# Altium project VatorMonitor.PrjPcb
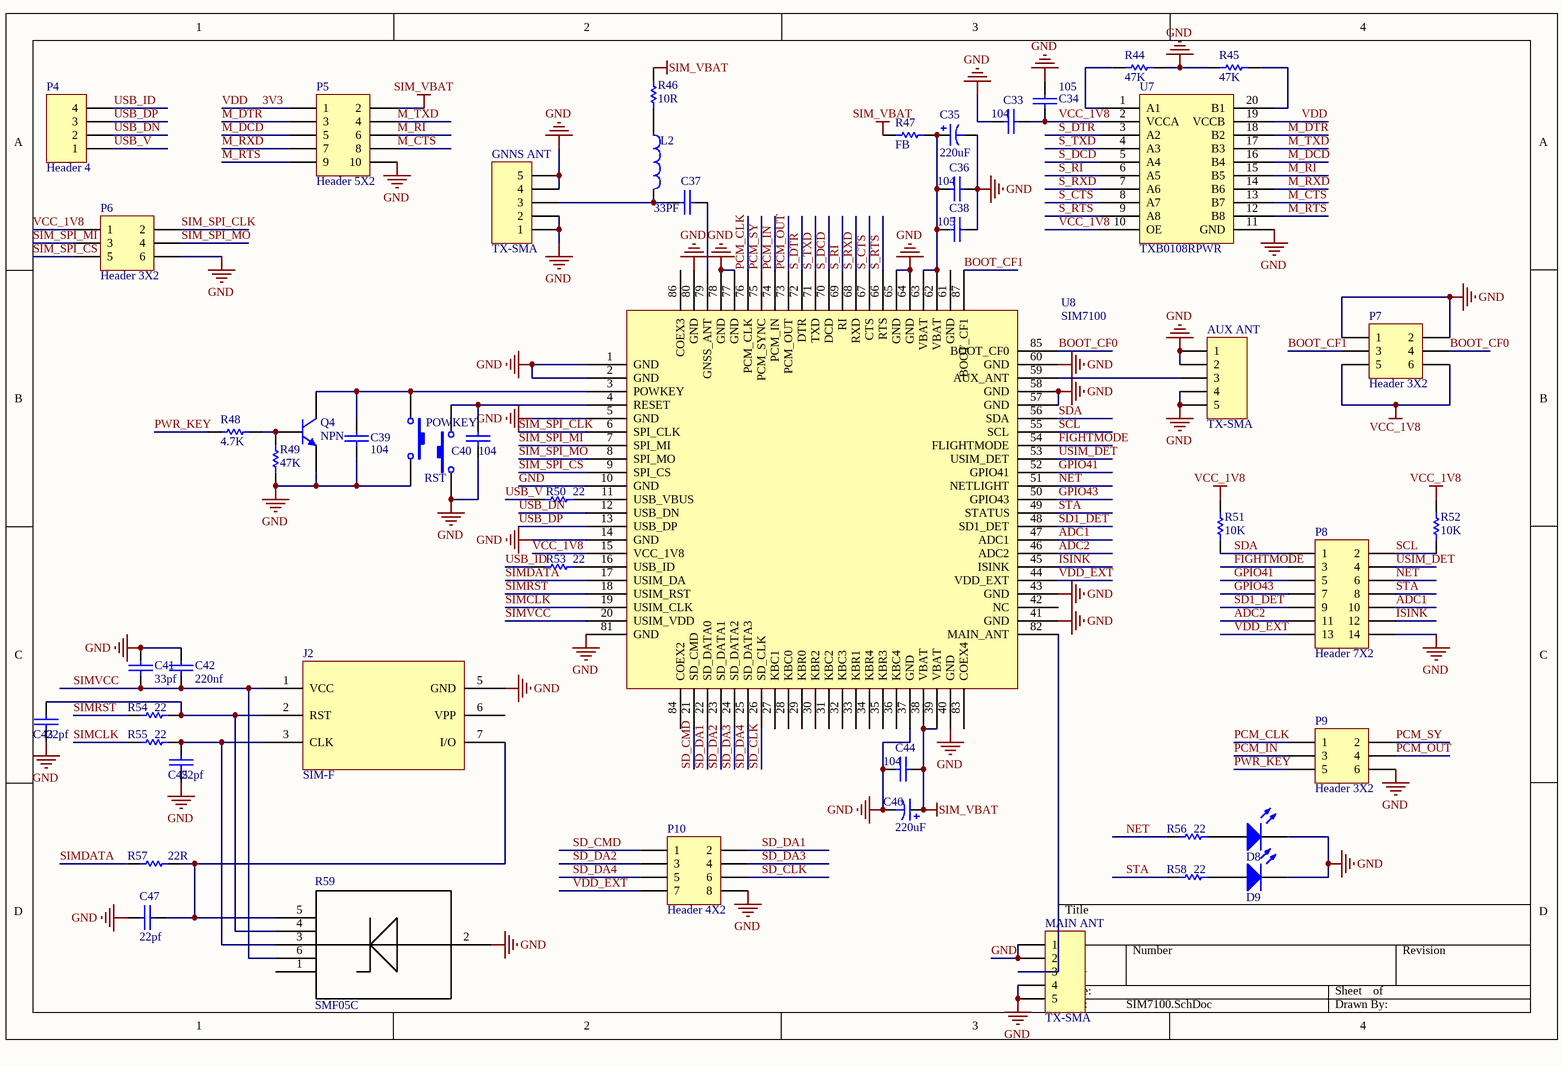
[diagram p0: SIM7100.SchDoc]
6 sheets, 122 parts. Net scope: flat (ports and power ports of the same name join across sheets).
Board file: VatorMonitor.PcbDoc
Sheets:
  SIM7100.SchDoc
  LCD.SchDoc
  LED_KEYBOARD.SchDoc
  MCU.SchDoc
  MCU_DBG.SchDoc
  PIN_HEADER.SchDoc

## Sheet SIM7100.SchDoc
size A4

### Parts
(Parts that share a designator on the sheet are numbered #1, #2 ... from top to bottom, then left to right.)
AUX_ANT  TX-SMA  [SMA]
C33  104  [RC0805]
C34  105  [RC0805]
C35  value 220uF  [CAP(100uF)]  (hidden comment: 407uF)
C36  104  [RC0805]
C37  33PF  [RC0805]
C38  105  [RC0805]
C39  104  [RC0805]
C40  104  [RC0805]
C41  33pf  [RC0805]
C42  220nf  [RC0805]
C43  22pf  [RC0805]
C44  104  [RC0805]
C45  22pf  [RC0805]
C46  value 220uF  [CAP(100uF)]  (hidden comment: 407uF)
C47  22pf  [RC0805]
D8  LED0  [LED-0805]  (value not drawn)
D9  LED0  [LED-0805]  (value not drawn)
GNNS_ANT  TX-SMA  [SMA]
J2  SIM-F  [SIM_FG]
L2  Inductor  [RC0805]  (value not drawn)
MAIN_ANT  TX-SMA  [SMA]
P4  Header 4  [HDR1X4]
P5#1  Header 5X2  [HDR2X5]
P6#1  Header 3X2  [HDR2X3]
P7  Header 3X2  [HDR2X3]
P8  Header 7X2  [HDR2X7]
P9  Header 3X2  [HDR2X3]
P10  Header 4X2  [HDR2X4]
POWKEY  SW-PB  [小按键]  (value not drawn)
Q4  NPN  [to-92a]
R44  value 47K  [RC0805]  (hidden comment: Res1)
R45  value 47K  [RC0805]  (hidden comment: Res1)
R46  value 10R  [RC0805]  (hidden comment: Res1)
R47  value FB  [1206]  (hidden comment: Res1)
R48  value 4.7K  [RC0805]  (hidden comment: Res1)
R49  value 47K  [RC0805]  (hidden comment: Res1)
R50  value 22  [RC0805]  (hidden comment: Res1)
R51  value 10K  [RC0805]  (hidden comment: Res1)
R52  value 10K  [RC0805]  (hidden comment: Res1)
R53  value 22  [RC0805]  (hidden comment: Res1)
R54  value 22  [RC0805]  (hidden comment: Res1)
R55  value 22  [RC0805]  (hidden comment: Res1)
R56  value 22  [RC0805]  (hidden comment: Res1)
R57  value 22R  [RC0805]  (hidden comment: Res1)
R58  value 22  [RC0805]  (hidden comment: Res1)
R59  SMF05C  [SOT-363]
RST  SW-PB  [小按键]  (value not drawn)
U7  TXB0108RPWR  [R-PDSO-20]
U8  SIM7100  [SIM7100]

### Nets
GND: AUX_ANT.1 AUX_ANT.2 AUX_ANT.4 AUX_ANT.5 C33.1 C34.2 C35.2 C36.2 C38.2 C39.2 C40.2 C41.2 C42.2 C43.1 C44.1 C45.1 C46.2 C47.2 D8.2(K) D9.2(K) GNNS_ANT.1 GNNS_ANT.2 GNNS_ANT.4 GNNS_ANT.5 J2.5(GND) MAIN_ANT.1 MAIN_ANT.2 MAIN_ANT.4 MAIN_ANT.5 P5#1.10 P6#1.6 P7.1 P7.2 P8.14 P9.6 P10.8 POWKEY.2 Q4.1(E) R44.1 R45.2 R49.1 R59.2(I/O) RST.1 U7.11(GND) U8.1(GND) U8.2(GND) U8.5(GND) U8.10(GND) U8.14(GND) U8.37(GND) U8.40(GND) U8.41(GND) U8.43(GND) U8.57(GND) U8.58(GND) U8.60(GND) U8.64(GND) U8.65(GND) U8.77(GND) U8.78(GND) U8.80(GND) U8.81(GND)
SIM_VBAT: C44.2 C46.1 P5#1.2 R46.2 R47.1 U8.38(VBAT) U8.39(VBAT)
VCC_1V8: C33.2 C34.1 P6#1.1 P7.5 P7.6 R51.2 R52.2 U7.2(VCCA) U7.10(OE) U8.15(VCC_1V8)
3V3: P5#1.1 U7.19(VCCB)  [also labelled VDD]
ADC1: P8.10 U8.47(ADC1)
ADC2: P8.11 U8.46(ADC2)
BOOT_CF0: P7.4 U8.85(BOOT_CF0)
BOOT_CF1: P7.3 U8.87(BOOT_CF1)
FIGHTMODE: P8.3 U8.54(FLIGHTMODE)
GPIO41: P8.5 U8.52(GPIO41)
GPIO43: P8.7 U8.50(GPIO43)
ISINK: P8.12 U8.45(ISINK)
M_CTS: P5#1.8 U7.13(B7)
M_DCD: P5#1.5 U7.16(B4)
M_DTR: P5#1.3 U7.18(B2)
M_RI: P5#1.6 U7.15(B5)
M_RTS: P5#1.9 U7.12(B8)
M_RXD: P5#1.7 U7.14(B6)
M_TXD: P5#1.4 U7.17(B3)
NET: P8.6 R56.1 U8.51(NETLIGHT)
PCM_CLK: P9.1 U8.76(PCM_CLK)
PCM_IN: P9.3 U8.74(PCM_IN)
PCM_OUT: P9.4 U8.73(PCM_OUT)
PCM_SY: P9.2 U8.75(PCM_SYNC)
PWR_KEY: P9.5 R48.1
S_CTS: U7.8(A7) U8.67(CTS)
S_DCD: U7.5(A4) U8.70(DCD)
S_DTR: U7.3(A2) U8.72(DTR)
S_RI: U7.6(A5) U8.69(RI)
S_RTS: U7.9(A8) U8.66(RTS)
S_RXD: U7.7(A6) U8.68(RXD)
S_TXD: U7.4(A3) U8.71(TXD)
SCL: P8.2 R52.1 U8.55(SCL)
SD1_DET: P8.9 U8.48(SD1_DET)
SD_CLK: P10.6 U8.26(SD_CLK)
SD_CMD: P10.1 U8.21(SD_CMD)
SD_DA1: P10.2 U8.22(SD_DATA0)
SD_DA2: P10.3 U8.23(SD_DATA1)
SD_DA3: P10.4 U8.24(SD_DATA2)
SD_DA4: P10.5 U8.25(SD_DATA3)
SDA: P8.1 R51.1 U8.56(SDA)
SIM_SPI_CLK: P6#1.2 U8.6(SPI_CLK)
SIM_SPI_CS: P6#1.5 U8.9(SPI_CS)
SIM_SPI_MI: P6#1.3 U8.7(SPI_MI)
SIM_SPI_MO: P6#1.4 U8.8(SPI_MO)
SIMCLK: R55.1 U8.19(USIM_CLK)
SIMDATA: R57.1 U8.17(USIM_DA)
SIMRST: R54.1 U8.18(USIM_RST)
SIMVCC: C41.1 C42.1 J2.1(VCC) R59.6(I/O) U8.20(USIM_VDD)
STA: P8.8 R58.1 U8.49(STATUS)
USB_DN: P4.2 U8.12(USB_DN)
USB_DP: P4.3 U8.13(USB_DP)
USB_ID: P4.4 R53.1
USB_V: P4.1 R50.1
USIM_DET: P8.4 U8.53(USIM_DET)
VDD_EXT: P8.13 P10.7 U8.44(VDD_EXT)
NetAUX_ANT_3: AUX_ANT.3 U8.59(AUX_ANT)
NetC35_1: C35.1 C36.1 C38.1 R47.2 U8.62(VBAT) U8.63(VBAT)
NetC37_1: C37.1 GNNS_ANT.3 L2.2
NetC37_2: C37.2 U8.79(GNSS_ANT)
NetC39_1: C39.1 POWKEY.1 Q4.3(C) U8.3(POWKEY)
NetC40_1: C40.1 RST.2 U8.4(RESET)
NetC43_2: C43.2 J2.2(RST) R54.2 R59.4(I/O)
NetC45_2: C45.2 J2.3(CLK) R55.2 R59.3(I/O)
NetC47_1: C47.1 J2.7(I/O) R57.2 R59.5(I/O)
NetD8_1: D8.1(A) R56.2
NetD9_1: D9.1(A) R58.2
NetL2_1: L2.1 R46.1
NetMAIN_ANT_3: MAIN_ANT.3 U8.82(MAIN_ANT)
NetQ4_2: Q4.2(B) R48.2 R49.2
NetR44_2: R44.2 U7.1(A1)
NetR45_1: R45.1 U7.20(B1)
NetR50_2: R50.2 U8.11(USB_VBUS)
NetR53_2: R53.2 U8.16(USB_ID)

Not connected (* = marked no-connect by the designer): J2 6(VPP); R59 1(I/O); U8 27(KBC1) 28(KBC0) 29(KBR0) 30(KBR2) 31(KBC2) 32(KBC3) 33(KBR1) 34(KBR4) 35(KBR3) 36(KBC4) 42(NC) 61(GND) 83(COEX4) 84(COEX2) 86(COEX3)

### Library data of the parts
AUX_ANT GNNS_ANT MAIN_ANT = Header 5: Header, 5-Pin; LatestRevisionDate: 17-Jul-2002; LatestRevisionNote: Re-released for DXP Platform.; Publisher: Altium Limited
C33 C34 C36-C45 C47 = CAP: Capacitor
C35 C46 = Cap Pol1: Polarized Capacitor (Radial); Published: 8-Jun-2000; LatestRevisionDate: 17-Jul-2002; LatestRevisionNote: Re-released for DXP Platform.; PackageReference: RB7.6-15; Publisher: Altium Limited
D8 D9 = LED0: Typical INFRARED GaAs LED; Published: 8-Jun-2000; LatestRevisionDate: 08-Jul-2005; LatestRevisionNote: Mech Layer 1 removed.; PackageReference: LED-0; Publisher: Altium Limited; PackageDescription: LED; 2 Leads
L2 = Inductor: Code_IEC: 1005; Value: 10mH; Published: 8-Jun-2000; LatestRevisionDate: 29-May-2009; LatestRevisionNote: IPC-7351 Footprint Added.; PackageReference: 0402-A; Publisher: Altium Limited; PackageDescription: Chip Inductor; Code_JEITA: 0402
P4 = Header 4: Header, 4-Pin; LatestRevisionDate: 17-Jul-2002; LatestRevisionNote: Re-released for DXP Platform.; Publisher: Altium Limited
P5#1 = Header 5X2: Header, 5-Pin, Dual row; LatestRevisionDate: 17-Jul-2002; LatestRevisionNote: Re-released for DXP Platform.; Publisher: Altium Limited
P6#1 P7 P9 = Header 3X2: Header, 3-Pin, Dual row; LatestRevisionDate: 17-Jul-2002; LatestRevisionNote: Re-released for DXP Platform.; Publisher: Altium Limited
P8 = Header 7X2: Header, 7-Pin, Dual row; LatestRevisionDate: 17-Jul-2002; LatestRevisionNote: Re-released for DXP Platform.; Publisher: Altium Limited
P10 = Header 4X2: Header, 4-Pin, Dual row; LatestRevisionDate: 17-Jul-2002; LatestRevisionNote: Re-released for DXP Platform.; Publisher: Altium Limited
POWKEY RST = SW-PB: Switch; Published: 24-Mar-1999; LatestRevisionDate: 17-Jul-2002; LatestRevisionNote: Re-released for DXP Platform.; PackageReference: SPST-2; Publisher: Altium Limited; PackageDescription: Switch; 2 Leads
Q4 = 2N3904: NPN General Purpose Amplifier; Published: 8-Jun-2000; LatestRevisionDate: 15-Jan-2003; LatestRevisionNote: PCB Footprint 'BCY-W3/D4.7' replaced; DatasheetVersion: 1997; PackageVersion: Sep-1998; PackageReference: TO-92A; Publisher: Altium Limited; PackageDescription: TO, Flat Index; 3 In-Line, Axial Leads; Body Dia. 4.5mm; Leads 0.51 x 0.48 mm (max); ComponentLink1Description: Manufacturer Link; ComponentLink1URL: http://www.fairchildsemi.com/; ComponentLink2Description: Datasheet; ComponentLink2URL: http://www.fairchildsemi.com/ds/2N%2F2N3904.pdf
R44-R58 = Res1: Resistor; Published: 8-Jun-2000; LatestRevisionDate: 17-Jul-2002; LatestRevisionNote: Re-released for DXP Platform.; PackageReference: AXIAL-0.3; Publisher: Altium Limited; PackageDescription: Axial Device, Thru-Hole; 2 Leads; 0.3 in Pin Spacing

## Sheet LCD.SchDoc
size A4
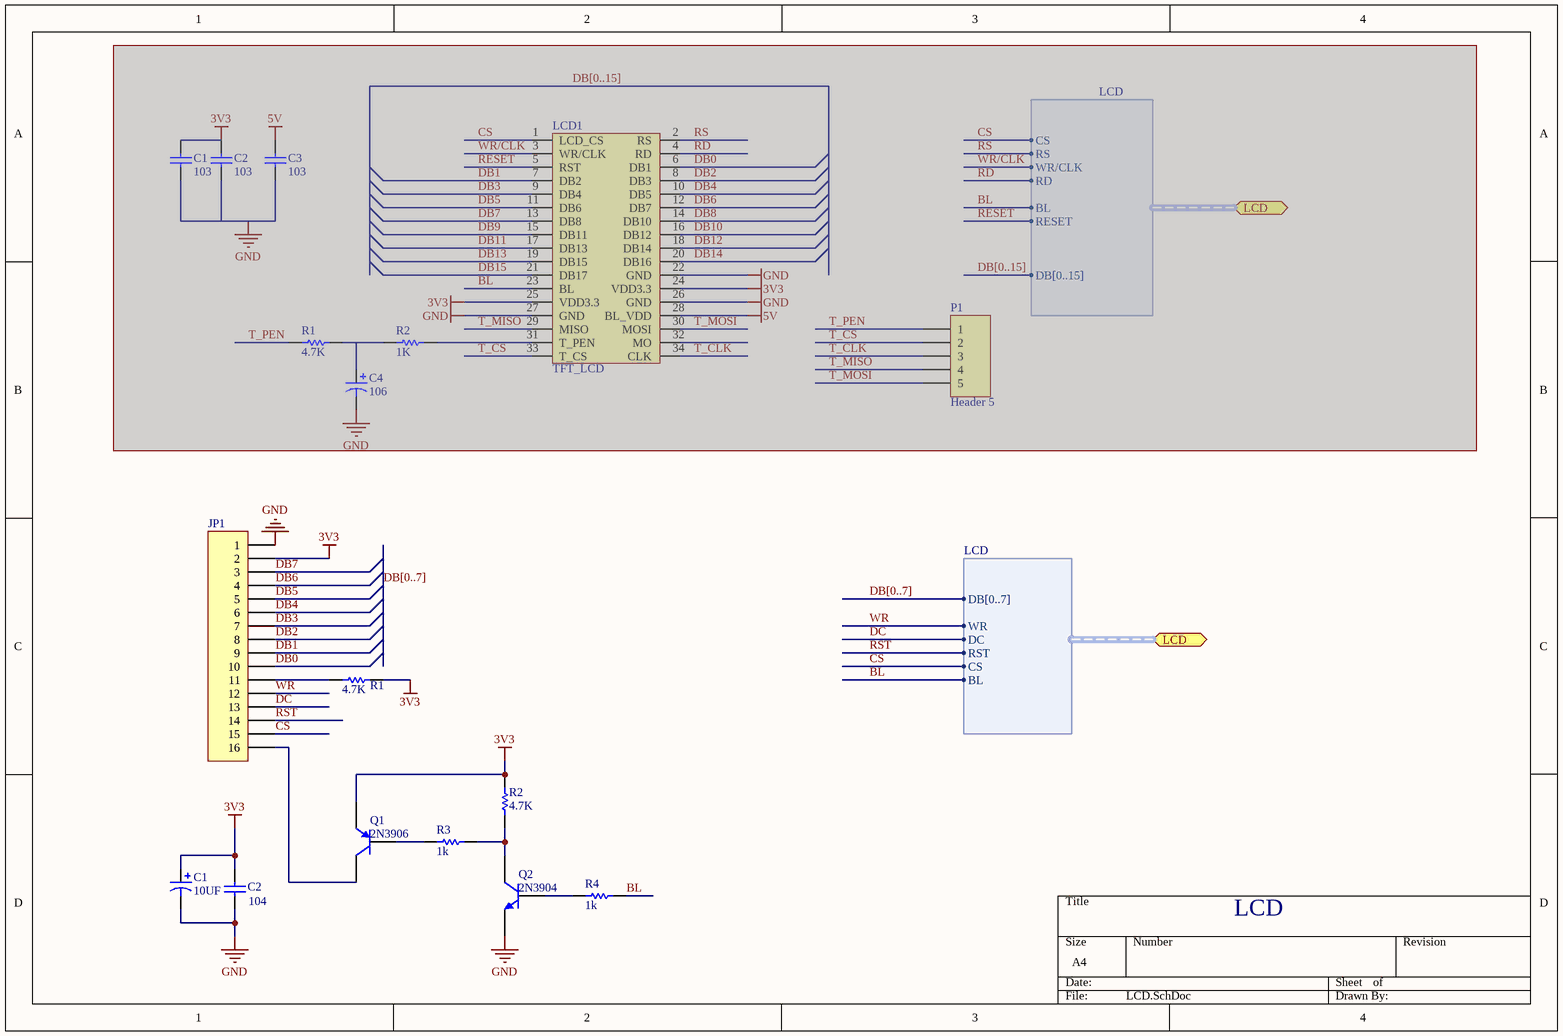
[diagram p1: LCD.SchDoc]

### Parts
(Parts that share a designator on the sheet are numbered #1, #2 ... from top to bottom, then left to right.)
C1#1  value 103  [RC0805]  (hidden comment: Cap)  (masked out: inside a compile mask, not in the netlist)
C1#2  value 10UF  [CAP(106C)]  (hidden comment: Cap Pol1)
C2#1  value 103  [RC0805]  (hidden comment: Cap)  (masked out: inside a compile mask, not in the netlist)
C2#2  value 104  [RC0805]  (hidden comment: Cap)
C3#1  value 103  [RC0805]  (hidden comment: Cap)  (masked out: inside a compile mask, not in the netlist)
C4#1  value 106  [CAP(106C)]  (hidden comment: Cap Pol1)  (masked out: inside a compile mask, not in the netlist)
JP1  Header 16  [LCD240120]  (value not drawn)
LCD1  TFT_LCD  [DB2*17]  (masked out: inside a compile mask, not in the netlist)
P1#1  Header 5  [HDR1X5]  (masked out: inside a compile mask, not in the netlist)
Q1  2N3906  [SOT-23R]
Q2  2N3904  [SOT-23R]
R1#1  value 4.7K  [RC0805]  (hidden comment: Res1)  (masked out: inside a compile mask, not in the netlist)
R1#2  value 4.7K  [RC0805]  (hidden comment: Res1)
R2#1  value 1K  [RC0805]  (hidden comment: Res1)  (masked out: inside a compile mask, not in the netlist)
R2#2  value 4.7K  [RC0805]  (hidden comment: Res1)
R3  value 1k  [RC0805]  (hidden comment: Res1)
R4  value 1k  [RC0805]  (hidden comment: Res1)

### Ports
LCD (harness LCD)

### Harnesses
LCD: CS, RS, WR/CLK, RD, BL, RESET, DB[0..15]
LCD: DB[0..7], WR, DC, RST, CS, BL

### Nets
3V3: C1#2.1 C2#2.1 JP1.2 Q1.1(E) R1#2.2 R2#2.2
GND: C1#2.2 C2#2.2 JP1.1 Q2.1(E)
BL: R4.2 ; port LCD.BL
CS: JP1.15 ; port LCD.CS
DB0: JP1.10
DB1: JP1.9
DB2: JP1.8
DB3: JP1.7
DB4: JP1.6
DB5: JP1.5
DB6: JP1.4
DB7: JP1.3
DC: JP1.13 ; port LCD.DC
RST: JP1.14 ; port LCD.RST  [project net LCD.RST]
WR: JP1.12 ; port LCD.WR  [project net LCD.WR]
NetJP1_11: JP1.11 R1#2.1
NetJP1_16: JP1.16 Q1.3(C)
NetQ1_2: Q1.2(B) R3.1
NetQ2_2: Q2.2(B) R4.1
NetQ2_3: Q2.3(C) R2#2.1 R3.2

### Buses and harness runs
bus DB[0..7]

### Notes on the sheet
- LCD

### Library data of the parts
C1#1 C2#1 C2#2 C3#1 = Cap: Capacitor; Published: 8-Jun-2000; LatestRevisionDate: 17-Jul-2002; LatestRevisionNote: Re-released for DXP Platform.; PackageReference: RAD-0.3; Publisher: Altium Limited; PackageDescription: Radial Cap, Thru-Hole; 2 Leads; 0.3 in Pin Spacing
C1#2 C4#1 = Cap Pol1: Polarized Capacitor (Radial); Published: 8-Jun-2000; LatestRevisionDate: 17-Jul-2002; LatestRevisionNote: Re-released for DXP Platform.; PackageReference: RB7.6-15; Publisher: Altium Limited; PackageDescription: Polarized Capacitor (Radial); 2 Leads
JP1 = Header 16: Header, 16-Pin; Revision: 17-Jul-2002: Re-released for DXP Platform.; Publisher: Altium Limited
P1#1 = Header 5: Header, 5-Pin; LatestRevisionDate: 17-Jul-2002; LatestRevisionNote: Re-released for DXP Platform.; Publisher: Altium Limited
Q1 = 2N3906: PNP General Purpose Amplifier; Published: 8-Jun-2000; LatestRevisionDate: 15-Jan-2003; LatestRevisionNote: PCB Footprint 'BCY-W3/D4.7' replaced; DatasheetVersion: 1997; PackageVersion: Sep-1998; PackageReference: TO-92A; Publisher: Altium Limited; PackageDescription: TO, Flat Index; 3 In-Line, Axial Leads; Body Dia. 4.5mm; Leads 0.51 x 0.48 mm (max); ComponentLink1Description: Manufacturer Link; ComponentLink1URL: http://www.fairchildsemi.com/; ComponentLink2Description: Datasheet; ComponentLink2URL: http://www.fairchildsemi.com/ds/2N%2F2N3906.pdf
Q2 = 2N3904: NPN General Purpose Amplifier; Published: 8-Jun-2000; LatestRevisionDate: 15-Jan-2003; LatestRevisionNote: PCB Footprint 'BCY-W3/D4.7' replaced; DatasheetVersion: 1997; PackageVersion: Sep-1998; PackageReference: TO-92A; Publisher: Altium Limited; PackageDescription: TO, Flat Index; 3 In-Line, Axial Leads; Body Dia. 4.5mm; Leads 0.51 x 0.48 mm (max); ComponentLink1Description: Manufacturer Link; ComponentLink1URL: http://www.fairchildsemi.com/; ComponentLink2Description: Datasheet; ComponentLink2URL: http://www.fairchildsemi.com/ds/2N%2F2N3904.pdf
R1#1 R1#2 R2#1 R2#2 R3 R4 = Res1: Resistor; Published: 8-Jun-2000; LatestRevisionDate: 17-Jul-2002; LatestRevisionNote: Re-released for DXP Platform.; PackageReference: AXIAL-0.3; Publisher: Altium Limited; PackageDescription: Axial Device, Thru-Hole; 2 Leads; 0.3 in Pin Spacing

## Sheet LED_KEYBOARD.SchDoc
size A4
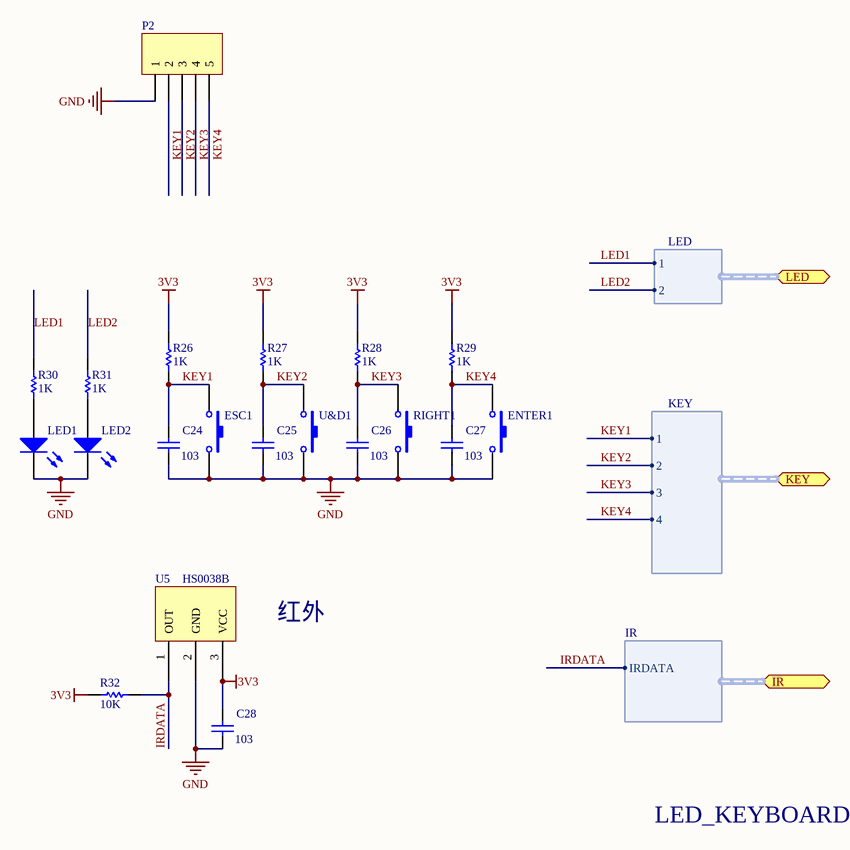
[diagram p2: LED_KEYBOARD.SchDoc]

### Parts
C24  value 103  [RC0805]  (hidden comment: Cap)
C25  value 103  [RC0805]  (hidden comment: Cap)
C26  value 103  [RC0805]  (hidden comment: Cap)
C27  value 103  [RC0805]  (hidden comment: Cap)
C28  value 103  [RC0805]  (hidden comment: Cap)
ENTER1  SW-PB  [KEY6*6(LARGE)]  (value not drawn)
ESC1  SW-PB  [KEY6*6(LARGE)]  (value not drawn)
LED1  LED0  [LED]  (value not drawn)
LED2  LED0  [LED]  (value not drawn)
P2  Header 5  [HDR1X5]  (value not drawn)
R26  value 1K  [RC0805]  (hidden comment: Res1)
R27  value 1K  [RC0805]  (hidden comment: Res1)
R28  value 1K  [RC0805]  (hidden comment: Res1)
R29  value 1K  [RC0805]  (hidden comment: Res1)
R30  value 1K  [RC0805]  (hidden comment: Res1)
R31  value 1K  [RC0805]  (hidden comment: Res1)
R32  value 10K  [RC0805]  (hidden comment: Res1)
RIGHT1  SW-PB  [KEY6*6(LARGE)]  (value not drawn)
U5  HS0038B  [HS0038]
U&D1  SW-PB  [KEY6*6(LARGE)]  (value not drawn)

### Ports
IR (harness IR), KEY (harness KEY), LED (harness LED)

### Harnesses
LED: 1, 2
KEY: 1, 2, 3, 4
IR: IRDATA

### Nets
3V3: C28.2 R26.1 R27.1 R28.1 R29.1 R32.1 U5.3(VCC)
GND: C24.1 C25.1 C26.1 C27.1 C28.1 ENTER1.2 ESC1.2 LED1.2(K) LED2.2(K) P2.1 RIGHT1.2 U5.2(GND) U&D1.2
IRDATA: R32.2 U5.1(OUT) ; port IR.IRDATA  [project net IR.IRDATA]
KEY1: C24.2 ESC1.1 P2.2 R26.2 ; port KEY.1  [project net KEY.1]
KEY2: C25.2 P2.3 R27.2 U&D1.1 ; port KEY.2  [project net KEY.2]
KEY3: C26.2 P2.4 R28.2 RIGHT1.1 ; port KEY.3  [project net KEY.3]
KEY4: C27.2 ENTER1.1 P2.5 R29.2 ; port KEY.4  [project net KEY.4]
LED1: R30.2 ; port LED.1  [project net LED.1]
LED2: R31.2 ; port LED.2  [project net LED.2]
NetLED1_1: LED1.1(A) R30.1
NetLED2_1: LED2.1(A) R31.1

### Notes on the sheet
- 红外
- LED_KEYBOARD

### Library data of the parts
C24-C28 = Cap: Capacitor; Published: 8-Jun-2000; LatestRevisionDate: 17-Jul-2002; LatestRevisionNote: Re-released for DXP Platform.; PackageReference: RAD-0.3; Publisher: Altium Limited; PackageDescription: Radial Cap, Thru-Hole; 2 Leads; 0.3 in Pin Spacing
ENTER1 ESC1 RIGHT1 U&D1 = SW-PB: Switch; Published: 24-Mar-1999; LatestRevisionDate: 17-Jul-2002; LatestRevisionNote: Re-released for DXP Platform.; PackageReference: SPST-2; Publisher: Altium Limited; PackageDescription: Switch; 2 Leads
LED1 LED2 = LED0: Typical INFRARED GaAs LED; Published: 8-Jun-2000; LatestRevisionDate: 08-Jul-2005; LatestRevisionNote: Mech Layer 1 removed.; PackageReference: LED-0; Publisher: Altium Limited; PackageDescription: LED; 2 Leads
P2 = Header 5: Header, 5-Pin; LatestRevisionDate: 17-Jul-2002; LatestRevisionNote: Re-released for DXP Platform.; Publisher: Altium Limited
R26-R32 = Res1: Resistor; Published: 8-Jun-2000; LatestRevisionDate: 17-Jul-2002; LatestRevisionNote: Re-released for DXP Platform.; PackageReference: AXIAL-0.3; Publisher: Altium Limited; PackageDescription: Axial Device, Thru-Hole; 2 Leads; 0.3 in Pin Spacing

## Sheet MCU.SchDoc
size A4
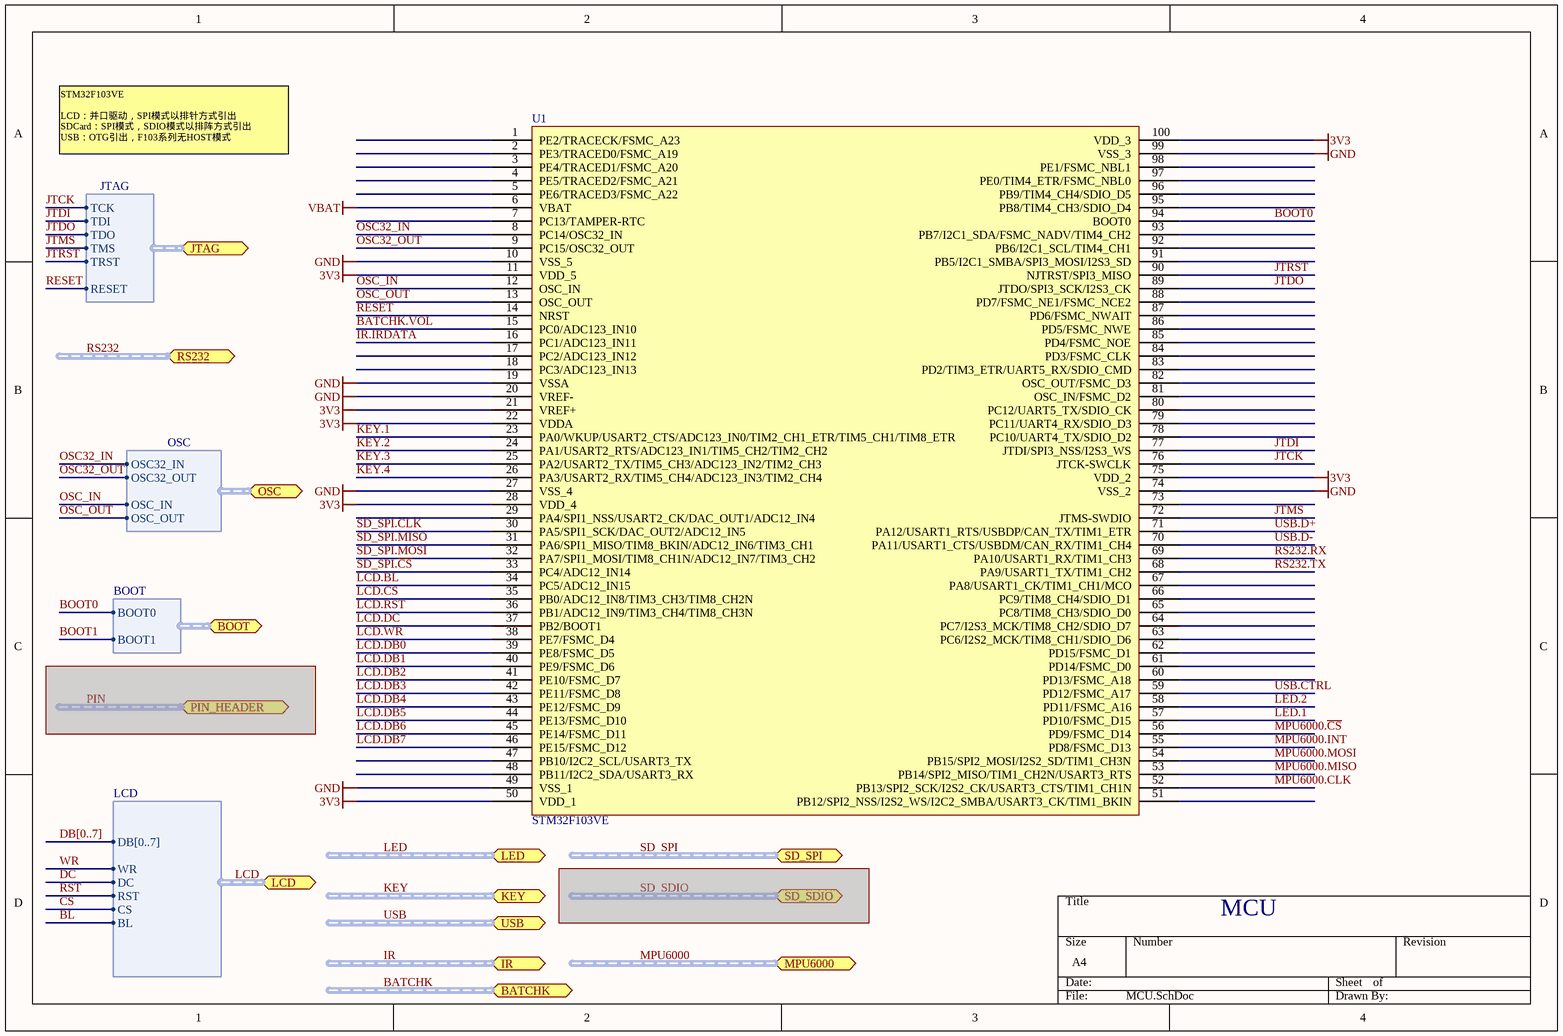
[diagram p3: MCU.SchDoc]

### Parts
U1  STM32F103VE  [LQFP100_M]

### Ports
BATCHK (harness BATCHK), BOOT (harness BOOT), IR (harness IR), JTAG (harness JTAG), KEY (harness KEY), LCD (harness LCD), LED (harness LED), MPU6000 (harness MPU6000), OSC (harness OSC), PIN_HEADER (harness PIN_HEADER), RS232 (harness RS232), SD_SDIO (harness SD_SDIO), SD_SPI (harness SD_SPI), USB (harness USB)

### Harnesses
JTAG: TCK, TDI, TDO, TMS, TRST, RESET
OSC: OSC32_IN, OSC32_OUT, OSC_IN, OSC_OUT
BOOT: BOOT0, BOOT1
LCD: DB[0..7], WR, DC, RST, CS, BL

### Nets
3V3: U1.11(VDD_5) U1.21(VREF+) U1.22(VDDA) U1.28(VDD_4) U1.50(VDD_1) U1.75(VDD_2) U1.100(VDD_3)
GND: U1.10(VSS_5) U1.19(VSSA) U1.20(VREF-) U1.27(VSS_4) U1.49(VSS_1) U1.74(VSS_2) U1.99(VSS_3)
VBAT: U1.6(VBAT)
BATCHK.VOL: U1.15(PC0/ADC123_IN10)
BOOT0: U1.94(BOOT0) ; port BOOT.BOOT0
BOOT1: port BOOT.BOOT1
IR.IRDATA: U1.16(PC1/ADC123_IN11)
JTCK: U1.76(JTCK-SWCLK) ; port JTAG.TCK
JTDI: U1.77(JTDI/SPI3_NSS/I2S3_WS) ; port JTAG.TDI
JTDO: U1.89(JTDO/SPI3_SCK/I2S3_CK) ; port JTAG.TDO
JTMS: U1.72(JTMS-SWDIO) ; port JTAG.TMS
JTRST: U1.90(NJTRST/SPI3_MISO) ; port JTAG.TRST
KEY.1: U1.23(PA0/WKUP/USART2_CTS/ADC123_IN0/TIM2_CH1_ETR/TIM5_CH1/TIM8_ETR)
KEY.2: U1.24(PA1/USART2_RTS/ADC123_IN1/TIM5_CH2/TIM2_CH2)
KEY.3: U1.25(PA2/USART2_TX/TIM5_CH3/ADC123_IN2/TIM2_CH3)
KEY.4: U1.26(PA3/USART2_RX/TIM5_CH4/ADC123_IN3/TIM2_CH4)
LCD.BL: U1.34(PC5/ADC12_IN15)
LCD.CS: U1.35(PB0/ADC12_IN8/TIM3_CH3/TIM8_CH2N)
LCD.DB0: U1.39(PE8/FSMC_D5)
LCD.DB1: U1.40(PE9/FSMC_D6)
LCD.DB2: U1.41(PE10/FSMC_D7)
LCD.DB3: U1.42(PE11/FSMC_D8)
LCD.DB4: U1.43(PE12/FSMC_D9)
LCD.DB5: U1.44(PE13/FSMC_D10)
LCD.DB6: U1.45(PE14/FSMC_D11)
LCD.DB7: U1.46(PE15/FSMC_D12)
LCD.DC: U1.37(PB2/BOOT1)
LCD.RST: U1.36(PB1/ADC12_IN9/TIM3_CH4/TIM8_CH3N)
LCD.WR: U1.38(PE7/FSMC_D4)
LED.1: U1.57(PD10/FSMC_D15)
LED.2: U1.58(PD11/FSMC_A16)
MPU6000.~{CS}: U1.56(PD9/FSMC_D14)
MPU6000.CLK: U1.52(PB13/SPI2_SCK/I2S2_CK/USART3_CTS/TIM1_CH1N)
MPU6000.INT: U1.55(PD8/FSMC_D13)
MPU6000.MISO: U1.53(PB14/SPI2_MISO/TIM1_CH2N/USART3_RTS)
MPU6000.MOSI: U1.54(PB15/SPI2_MOSI/I2S2_SD/TIM1_CH3N)
OSC32_IN: U1.8(PC14/OSC32_IN) ; port OSC.OSC32_IN
OSC32_OUT: U1.9(PC15/OSC32_OUT) ; port OSC.OSC32_OUT
OSC_IN: U1.12(OSC_IN) ; port OSC.OSC_IN
OSC_OUT: U1.13(OSC_OUT) ; port OSC.OSC_OUT
RESET: U1.14(NRST) ; port JTAG.RESET
RS232.RX: U1.69(PA10/USART1_RX/TIM1_CH3)
RS232.TX: U1.68(PA9/USART1_TX/TIM1_CH2)
SD_SPI.~{CS}: U1.33(PC4/ADC12_IN14)
SD_SPI.CLK: U1.30(PA5/SPI1_SCK/DAC_OUT2/ADC12_IN5)
SD_SPI.MISO: U1.31(PA6/SPI1_MISO/TIM8_BKIN/ADC12_IN6/TIM3_CH1)
SD_SPI.MOSI: U1.32(PA7/SPI1_MOSI/TIM8_CH1N/ADC12_IN7/TIM3_CH2)
USB.CTRL: U1.59(PD12/FSMC_A17)
USB.D+: U1.71(PA12/USART1_RTS/USBDP/CAN_TX/TIM1_ETR)
USB.D-: U1.70(PA11/USART1_CTS/USBDM/CAN_RX/TIM1_CH4)

Not connected (* = marked no-connect by the designer): U1 1(PE2/TRACECK/FSMC_A23) 2(PE3/TRACED0/FSMC_A19) 3(PE4/TRACED1/FSMC_A20) 4(PE5/TRACED2/FSMC_A21) 5(PE6/TRACED3/FSMC_A22) 7(PC13/TAMPER-RTC) 17(PC2/ADC123_IN12) 18(PC3/ADC123_IN13) 29(PA4/SPI1_NSS/USART2_CK/DAC_OUT1/ADC12_IN4) 47(PB10/I2C2_SCL/USART3_TX) 48(PB11/I2C2_SDA/USART3_RX) 51(PB12/SPI2_NSS/I2S2_WS/I2C2_SMBA/USART3_CK/TIM1_BKIN) 60(PD13/FSMC_A18) 61(PD14/FSMC_D0) 62(PD15/FSMC_D1) 63(PC6/I2S2_MCK/TIM8_CH1/SDIO_D6) 64(PC7/I2S3_MCK/TIM8_CH2/SDIO_D7) 65(PC8/TIM8_CH3/SDIO_D0) 66(PC9/TIM8_CH4/SDIO_D1) 67(PA8/USART1_CK/TIM1_CH1/MCO) 73 78(PC10/UART4_TX/SDIO_D2) 79(PC11/UART4_RX/SDIO_D3) 80(PC12/UART5_TX/SDIO_CK) 81(OSC_IN/FSMC_D2) 82(OSC_OUT/FSMC_D3) 83(PD2/TIM3_ETR/UART5_RX/SDIO_CMD) 84(PD3/FSMC_CLK) 85(PD4/FSMC_NOE) 86(PD5/FSMC_NWE) 87(PD6/FSMC_NWAIT) 88(PD7/FSMC_NE1/FSMC_NCE2) 91(PB5/I2C1_SMBA/SPI3_MOSI/I2S3_SD) 92(PB6/I2C1_SCL/TIM4_CH1) 93(PB7/I2C1_SDA/FSMC_NADV/TIM4_CH2) 95(PB8/TIM4_CH3/SDIO_D4) 96(PB9/TIM4_CH4/SDIO_D5) 97(PE0/TIM4_ETR/FSMC_NBL0) 98(PE1/FSMC_NBL1)

### Buses and harness runs
bus DB[0..7]
harness BATCHK = port BATCHK
harness IR = port IR
harness KEY = port KEY
harness LCD = port LCD
harness LED = port LED
harness MPU6000 = port MPU6000
harness RS232 = port RS232
harness SD_SPI = port SD_SPI
harness USB = port USB

### Notes on the sheet
- STM32F103VE
  LCD：并口驱动，SPI模式以排针方式引出
  SDCard：SPI模式，SDIO模式以排阵方式引出
  USB：OTG引出，F103系列无HOST模式
- MCU

## Sheet MCU_DBG.SchDoc
size A4
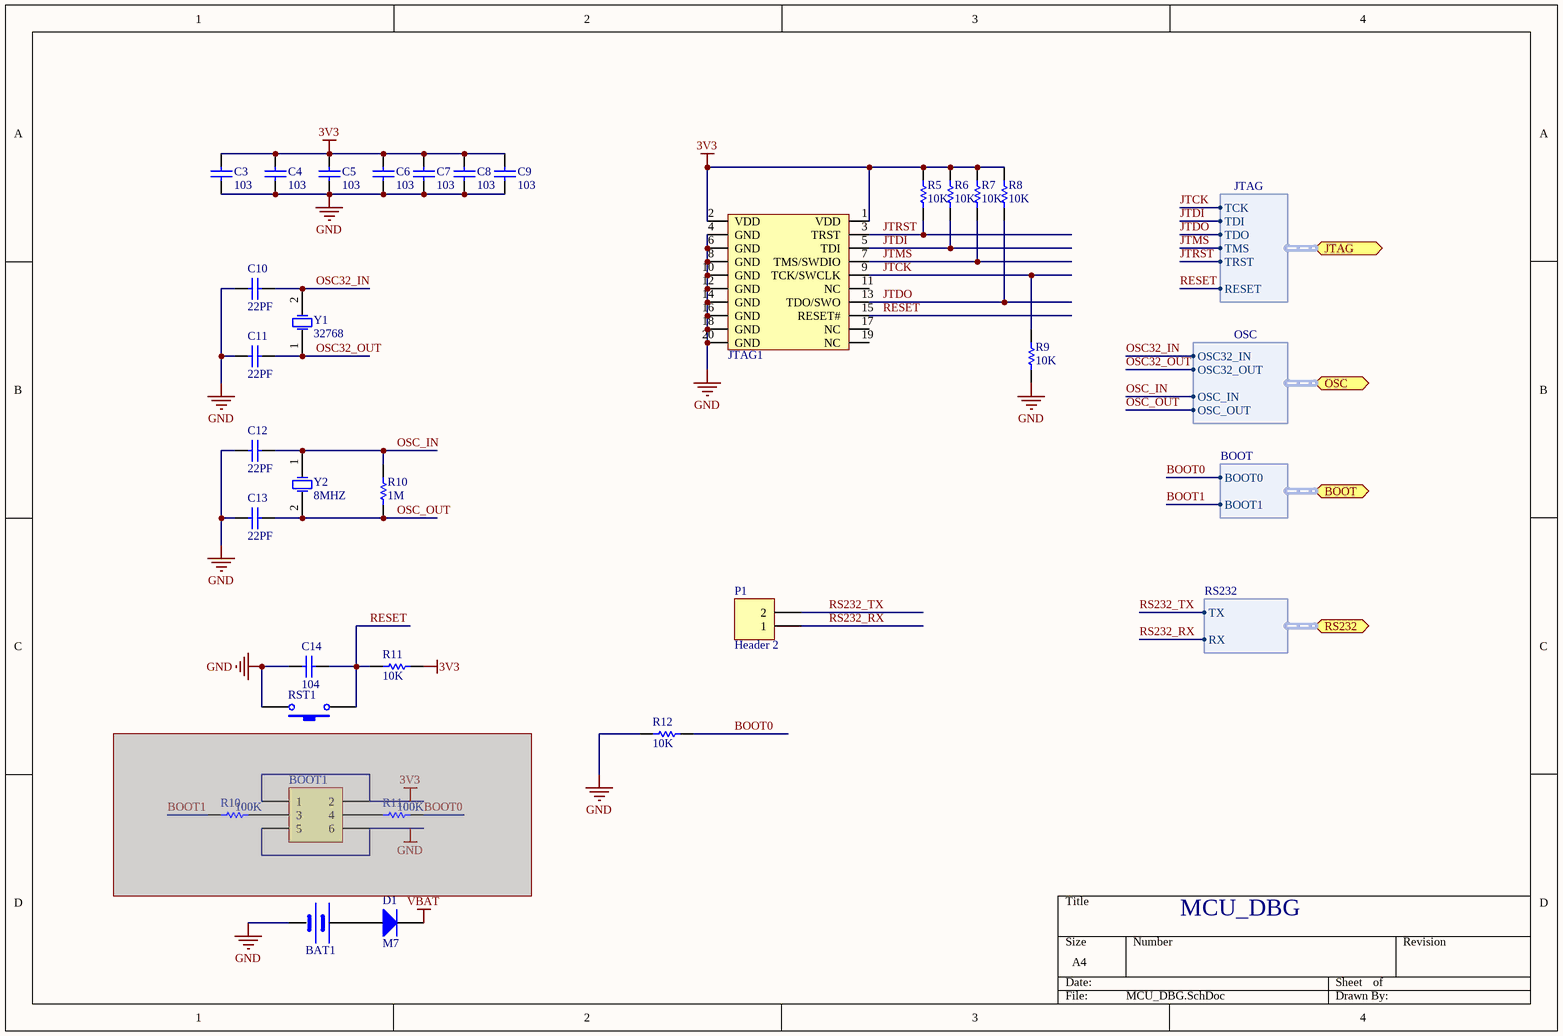
[diagram p4: MCU_DBG.SchDoc]

### Parts
(Parts that share a designator on the sheet are numbered #1, #2 ... from top to bottom, then left to right.)
BAT1  BATT  [Bat2032]  (value not drawn)
BOOT1  BOOT  [HDR2X3]  (value not drawn)  (masked out: inside a compile mask, not in the netlist)
C3#2  value 103  [RC0805]  (hidden comment: Cap)
C4#2  value 103  [RC0805]  (hidden comment: Cap)
C5  value 103  [RC0805]  (hidden comment: Cap)
C6  value 103  [RC0805]  (hidden comment: Cap)
C7  value 103  [RC0805]  (hidden comment: Cap)
C8  value 103  [RC0805]  (hidden comment: Cap)
C9  value 103  [RC0805]  (hidden comment: Cap)
C10  value 22PF  [RC0805]  (hidden comment: Cap)
C11  value 22PF  [RC0805]  (hidden comment: Cap)
C12  value 22PF  [RC0805]  (hidden comment: Cap)
C13  value 22PF  [RC0805]  (hidden comment: Cap)
C14  value 104  [RC0805]  (hidden comment: Cap)
D1  M7  [ss14]
JTAG1  JTAG  [JTAG_20]  (value not drawn)
P1#2  Header 2  [HDR1X2]
R5  value 10K  [RC0805]  (hidden comment: Res1)
R6  value 10K  [RC0805]  (hidden comment: Res1)
R7  value 10K  [RC0805]  (hidden comment: Res1)
R8  value 10K  [RC0805]  (hidden comment: Res1)
R9  value 10K  [RC0805]  (hidden comment: Res1)
R10#1  value 1M  [RC0805]  (hidden comment: Res1)
R10#2  value 100K  [RC0805]  (hidden comment: Res1)  (masked out: inside a compile mask, not in the netlist)
R11#1  value 10K  [RC0805]  (hidden comment: Res1)
R11#2  value 100K  [RC0805]  (hidden comment: Res1)  (masked out: inside a compile mask, not in the netlist)
R12  value 10K  [RC0805]  (hidden comment: Res1)
RST1  SW-PB  [KEY2*2(COMMON)]  (value not drawn)
Y1  32768  [XTAL32]
Y2  8MHZ  [OSC]

### Ports
BOOT (harness BOOT), JTAG (harness JTAG), OSC (harness OSC), RS232 (harness RS232)

### Harnesses
JTAG: TCK, TDI, TDO, TMS, TRST, RESET
OSC: OSC32_IN, OSC32_OUT, OSC_IN, OSC_OUT
BOOT: BOOT0, BOOT1
RS232: TX, RX

### Nets
3V3: C3#2.1 C4#2.1 C5.1 C6.1 C7.1 C8.1 C9.1 JTAG1.1(VDD) JTAG1.2(VDD) R5.2 R6.2 R7.2 R8.2 R11#1.2
GND: BAT1.2(GND) C3#2.2 C4#2.2 C5.2 C6.2 C7.2 C8.2 C9.2 C10.1 C11.1 C12.1 C13.1 C14.2 JTAG1.4(GND) JTAG1.6(GND) JTAG1.8(GND) JTAG1.10(GND) JTAG1.12(GND) JTAG1.14(GND) JTAG1.16(GND) JTAG1.18(GND) JTAG1.20(GND) R9.2 R12.1 RST1.2
VBAT: D1.2(K)
BOOT0: R12.2 ; port BOOT.BOOT0
BOOT1: port BOOT.BOOT1
JTCK: JTAG1.9(TCK/SWCLK) R9.1 ; port JTAG.TCK
JTDI: JTAG1.5(TDI) R6.1 ; port JTAG.TDI
JTDO: JTAG1.13(TDO/SWO) R8.1 ; port JTAG.TDO
JTMS: JTAG1.7(TMS/SWDIO) R7.1 ; port JTAG.TMS
JTRST: JTAG1.3(TRST) R5.1 ; port JTAG.TRST
OSC32_IN: C10.2 Y1.2(OSC2) ; port OSC.OSC32_IN
OSC32_OUT: C11.2 Y1.1(OSC1) ; port OSC.OSC32_OUT
OSC_IN: C12.2 R10#1.2 Y2.1(OSC1) ; port OSC.OSC_IN
OSC_OUT: C13.2 R10#1.1 Y2.2(OSC2) ; port OSC.OSC_OUT
RESET: C14.1 JTAG1.15(RESET#) R11#1.1 RST1.1 ; port JTAG.RESET
RS232_RX: P1#2.1 ; port RS232.RX  [project net RS232.RX]
RS232_TX: P1#2.2 ; port RS232.TX  [project net RS232.TX]
NetBAT1_1: BAT1.1(VCC) D1.1(A)

Not connected (* = marked no-connect by the designer): JTAG1 11(NC) 17(NC) 19(NC)

### Notes on the sheet
- MCU_DBG

### Library data of the parts
BAT1 = BAT
BOOT1 = Header 3X2: Header, 3-Pin, Dual row; LatestRevisionDate: 17-Jul-2002; LatestRevisionNote: Re-released for DXP Platform.; Publisher: Altium Limited
C3#2 C4#2 C5-C14 = Cap: Capacitor; Published: 8-Jun-2000; LatestRevisionDate: 17-Jul-2002; LatestRevisionNote: Re-released for DXP Platform.; PackageReference: RAD-0.3; Publisher: Altium Limited; PackageDescription: Radial Cap, Thru-Hole; 2 Leads; 0.3 in Pin Spacing
D1 = Diode: Default Diode; Published: 8-Jun-2000; LatestRevisionDate: 17-Jul-2002; LatestRevisionNote: Re-released for DXP Platform.; PackageVersion: Sep-1996; PackageReference: SMC; Publisher: Altium Limited; PackageDescription: DO-214-AB/SMC; 2 C-Bend Leads; Body 7.9 x 5.9 mm, inc. leads (LxW); Code_JEDEC: DO-214-AB
P1#2 = Header 2: Header, 2-Pin; LatestRevisionDate: 17-Jul-2002; LatestRevisionNote: Re-released for DXP Platform.; Publisher: Altium Limited
R5-R9 R10#1 R10#2 R11#1 R11#2 R12 = Res1: Resistor; Published: 8-Jun-2000; LatestRevisionDate: 17-Jul-2002; LatestRevisionNote: Re-released for DXP Platform.; PackageReference: AXIAL-0.3; Publisher: Altium Limited; PackageDescription: Axial Device, Thru-Hole; 2 Leads; 0.3 in Pin Spacing
RST1 = SW-PB: Switch; Published: 24-Mar-1999; LatestRevisionDate: 17-Jul-2002; LatestRevisionNote: Re-released for DXP Platform.; PackageReference: SPST-2; Publisher: Altium Limited; PackageDescription: Switch; 2 Leads
Y1 Y2 = XTAL: Crystal Oscillator; Published: 8-Jun-2000; LatestRevisionDate: 17-Jul-2002; LatestRevisionNote: Re-released for DXP Platform.; Publisher: Altium Limited
  Y1: PackageReference: R38; PackageDescription: Crystal, Thru-Hole; 2 Leads; Body 3.1 x 8.2 mm (Dia.xH)

## Sheet PIN_HEADER.SchDoc
size A4
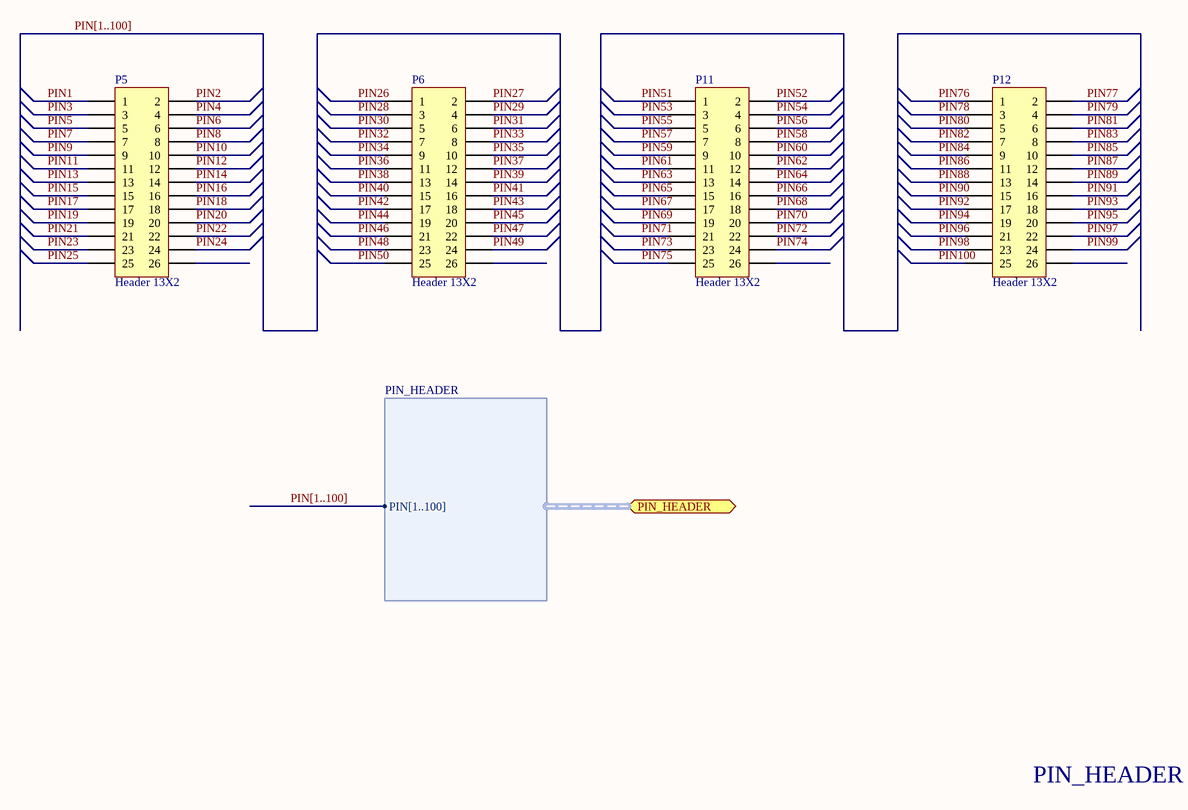
[diagram p5: PIN_HEADER.SchDoc]

### Parts
(Parts that share a designator on the sheet are numbered #1, #2 ... from top to bottom, then left to right.)
P5#2  Header 13X2  [HDR2X13]
P6#2  Header 13X2  [HDR2X13]
P11  Header 13X2  [HDR2X13]
P12  Header 13X2  [HDR2X13]

### Ports
PIN_HEADER (harness PIN_HEADER)

### Harnesses
PIN_HEADER: PIN[1..100]

### Nets
PIN1: P5#2.1
PIN2: P5#2.2
PIN3: P5#2.3
PIN4: P5#2.4
PIN5: P5#2.5
PIN6: P5#2.6
PIN7: P5#2.7
PIN8: P5#2.8
PIN9: P5#2.9
PIN10: P5#2.10
PIN11: P5#2.11
PIN12: P5#2.12
PIN13: P5#2.13
PIN14: P5#2.14
PIN15: P5#2.15
PIN16: P5#2.16
PIN17: P5#2.17
PIN18: P5#2.18
PIN19: P5#2.19
PIN20: P5#2.20
PIN21: P5#2.21
PIN22: P5#2.22
PIN23: P5#2.23
PIN24: P5#2.24
PIN25: P5#2.25
PIN26: P6#2.1
PIN27: P6#2.2
PIN28: P6#2.3
PIN29: P6#2.4
PIN30: P6#2.5
PIN31: P6#2.6
PIN32: P6#2.7
PIN33: P6#2.8
PIN34: P6#2.9
PIN35: P6#2.10
PIN36: P6#2.11
PIN37: P6#2.12
PIN38: P6#2.13
PIN39: P6#2.14
PIN40: P6#2.15
PIN41: P6#2.16
PIN42: P6#2.17
PIN43: P6#2.18
PIN44: P6#2.19
PIN45: P6#2.20
PIN46: P6#2.21
PIN47: P6#2.22
PIN48: P6#2.23
PIN49: P6#2.24
PIN50: P6#2.25
PIN51: P11.1
PIN52: P11.2
PIN53: P11.3
PIN54: P11.4
PIN55: P11.5
PIN56: P11.6
PIN57: P11.7
PIN58: P11.8
PIN59: P11.9
PIN60: P11.10
PIN61: P11.11
PIN62: P11.12
PIN63: P11.13
PIN64: P11.14
PIN65: P11.15
PIN66: P11.16
PIN67: P11.17
PIN68: P11.18
PIN69: P11.19
PIN70: P11.20
PIN71: P11.21
PIN72: P11.22
PIN73: P11.23
PIN74: P11.24
PIN75: P11.25
PIN76: P12.1
PIN77: P12.2
PIN78: P12.3
PIN79: P12.4
PIN80: P12.5
PIN81: P12.6
PIN82: P12.7
PIN83: P12.8
PIN84: P12.9
PIN85: P12.10
PIN86: P12.11
PIN87: P12.12
PIN88: P12.13
PIN89: P12.14
PIN90: P12.15
PIN91: P12.16
PIN92: P12.17
PIN93: P12.18
PIN94: P12.19
PIN95: P12.20
PIN96: P12.21
PIN97: P12.22
PIN98: P12.23
PIN99: P12.24
PIN100: P12.25

Not connected (* = marked no-connect by the designer): P5#2 26; P6#2 26; P11 26; P12 26

### Buses and harness runs
bus PIN[1..100]

### Notes on the sheet
- PIN_HEADER

### Library data of the parts
P5#2 P6#2 P11 P12 = Header 13X2: Header, 13-Pin, Dual row; LatestRevisionDate: 17-Jul-2002; LatestRevisionNote: Re-released for DXP Platform.; Publisher: Altium Limited

## Nets that join several sheets
3V3: LCD (6 pins), LED_KEYBOARD (7 pins), MCU (7 pins), MCU_DBG (14 pins)
GND: SIM7100 (62 pins), LCD (C1#2.2 C2#2.2 JP1.1 Q2.1), LED_KEYBOARD (13 pins), MCU (7 pins), MCU_DBG (25 pins)
VBAT: MCU (U1.6), MCU_DBG (D1.2)
BOOT0: MCU (U1.94), MCU_DBG (R12.2)
JTCK: MCU (U1.76), MCU_DBG (JTAG1.9 R9.1)
JTDI: MCU (U1.77), MCU_DBG (JTAG1.5 R6.1)
JTDO: MCU (U1.89), MCU_DBG (JTAG1.13 R8.1)
JTMS: MCU (U1.72), MCU_DBG (JTAG1.7 R7.1)
JTRST: MCU (U1.90), MCU_DBG (JTAG1.3 R5.1)
OSC32_IN: MCU (U1.8), MCU_DBG (C10.2 Y1.2)
OSC32_OUT: MCU (U1.9), MCU_DBG (C11.2 Y1.1)
OSC_IN: MCU (U1.12), MCU_DBG (C12.2 R10#1.2 Y2.1)
OSC_OUT: MCU (U1.13), MCU_DBG (C13.2 R10#1.1 Y2.2)
RESET: MCU (U1.14), MCU_DBG (C14.1 JTAG1.15 R11#1.1 RST1.1)